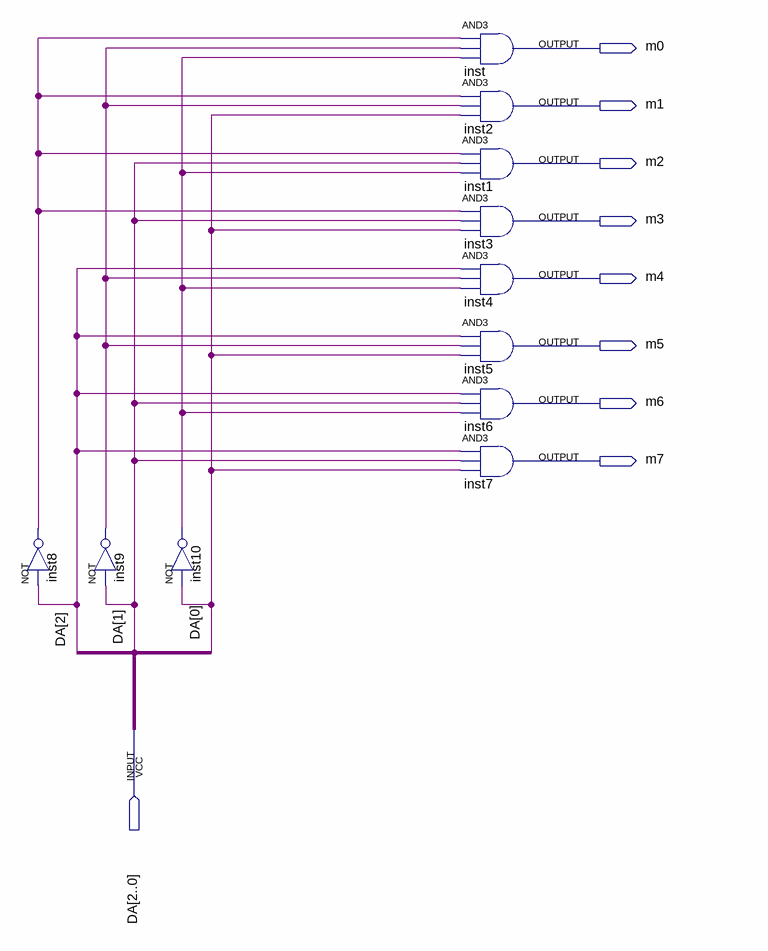
[diagram p0: schematic sheet]
// Quartus schematic 3to8_Decoder.bdf as structural Verilog: 11 symbols, 9 pins
module \3to8_Decoder  (
  input  [2:0] DA,
  output m0,
  output m1,
  output m2,
  output m3,
  output m4,
  output m5,
  output m6,
  output m7
);

  wire inst8_out, inst9_out, inst10_out;

  not inst8 (inst8_out, DA[2]);
  not inst9 (inst9_out, DA[1]);
  not inst10 (inst10_out, DA[0]);
  and inst (m0, inst8_out, inst9_out, inst10_out);
  and inst2 (m1, inst8_out, inst9_out, DA[0]);
  and inst1 (m2, inst8_out, DA[1], inst10_out);
  and inst3 (m3, inst8_out, DA[1], DA[0]);
  and inst4 (m4, DA[2], inst9_out, inst10_out);
  and inst5 (m5, DA[2], inst9_out, DA[0]);
  and inst6 (m6, DA[2], DA[1], inst10_out);
  and inst7 (m7, DA[2], DA[1], DA[0]);
endmodule
